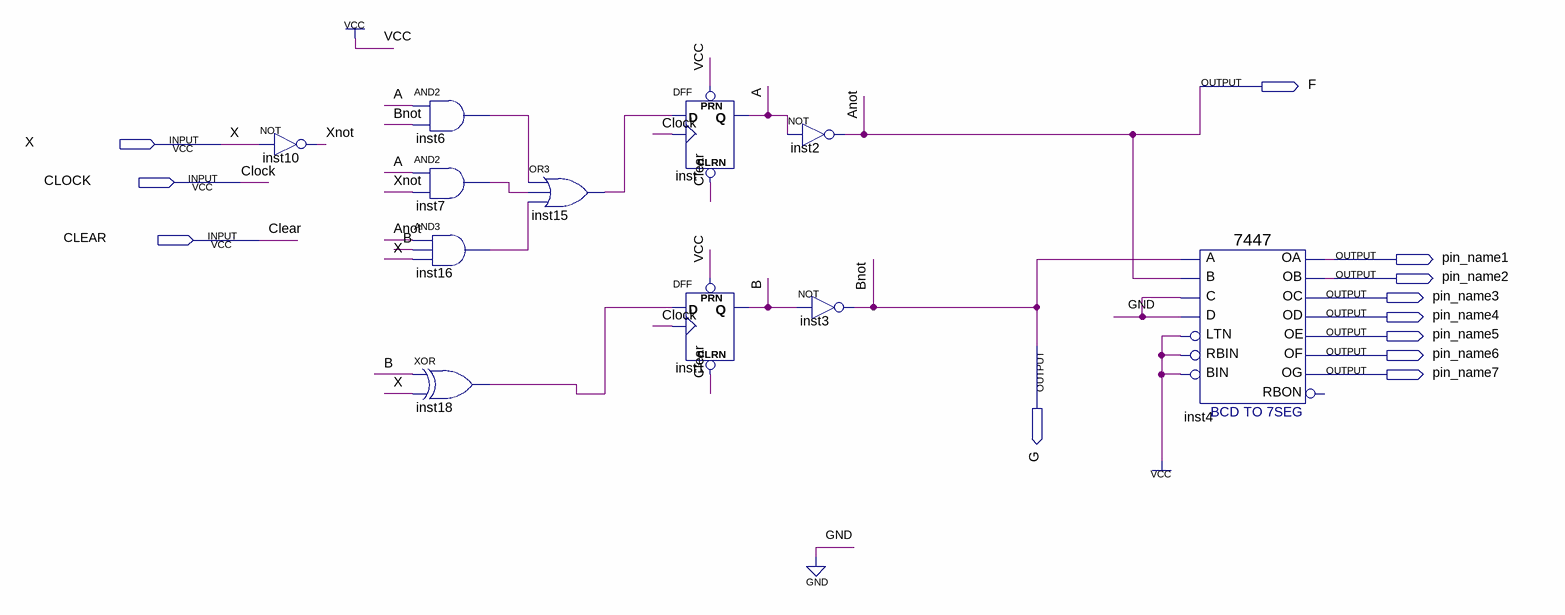
[diagram p0: schematic sheet]
// Quartus schematic Task2.bdf as structural Verilog: 11 symbols, 12 pins
module Task2 (
  input  X,
  input  CLOCK,
  input  CLEAR,
  output F,
  output pin_name1,
  output pin_name2,
  output pin_name3,
  output pin_name4,
  output pin_name5,
  output G,
  output pin_name6,
  output pin_name7
);

  wire A, B, inst6_out, inst7_out, inst15_out, inst16_out, inst18_out, Xnot;

  not inst10 (Xnot, X);
  and inst6 (inst6_out, A, G);
  and inst7 (inst7_out, A, Xnot);
  and inst16 (inst16_out, F, B, X);
  xor inst18 (inst18_out, B, X);
  or inst15 (inst15_out, inst6_out, inst7_out, inst16_out);
  DFF inst (.CLRN(CLEAR), .CLK(CLOCK), .D(inst15_out), .PRN(1'b1), .Q(A));
  DFF inst1 (.CLRN(CLEAR), .CLK(CLOCK), .D(inst18_out), .PRN(1'b1), .Q(B));
  not inst2 (F, A);
  not inst3 (G, B);
  \7447  inst4 (
    .LTN(1'b1), .B(F), .C(1'b0), .D(1'b0), .RBIN(1'b1), .BIN(1'b1), .A(G), .OB(pin_name2), .OC(pin_name3),
    .OE(pin_name5), .OD(pin_name4), .OF(pin_name6), .OG(pin_name7), .OA(pin_name1));  // open: RBON

  // Other names for the same wires on the sheet: Anot = F; Bnot = G
endmodule
